# Altium schematic sheet AK8975.SchDoc
size A4
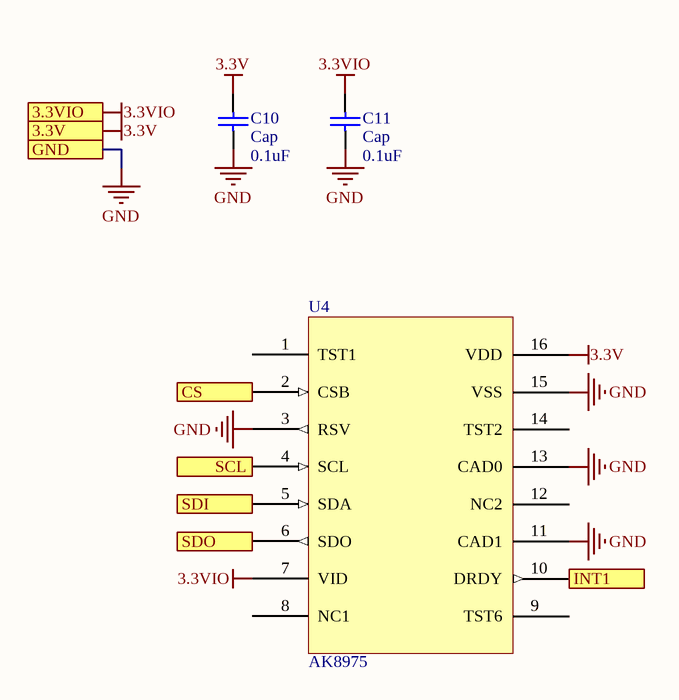
[diagram p0: AK8975.SchDoc]

## Parts
C10  Cap  value 0.1uF  [0603]
C11  Cap  value 0.1uF  [0603]
U4  AK8975  [AK8975]

## Ports
3.3V, 3.3VIO, CS (out), GND, INT1 (out), SCL (in), SDI (in), SDO (out)

## Nets
3.3V: C10.1 U4.16(VDD) ; port 3.3V
3.3VIO: C11.1 U4.7(VID) ; port 3.3VIO
GND: C10.2 C11.2 U4.3(RSV) U4.11(CAD1) U4.13(CAD0) U4.15(VSS) ; port GND
CS: U4.2(CSB) ; port CS
INT1: U4.10(DRDY) ; port INT1
SCL: U4.4(SCL) ; port SCL
SDI: U4.5(SDA) ; port SDI
SDO: U4.6(SDO) ; port SDO

Not connected (* = marked no-connect by the designer): U4 1(TST1) 8(NC1) 9(TST6) 12(NC2) 14(TST2)

## Library data of the parts
C10 C11 = Cap: Capacitor; Published: 8-Jun-2000; LatestRevisionDate: 17-Jul-2002; LatestRevisionNote: Re-released for DXP Platform.; PackageReference: RAD-0.3; Publisher: Altium Limited; PackageDescription: Radial Cap, Thru-Hole; 2 Leads; 0.3 in Pin Spacing